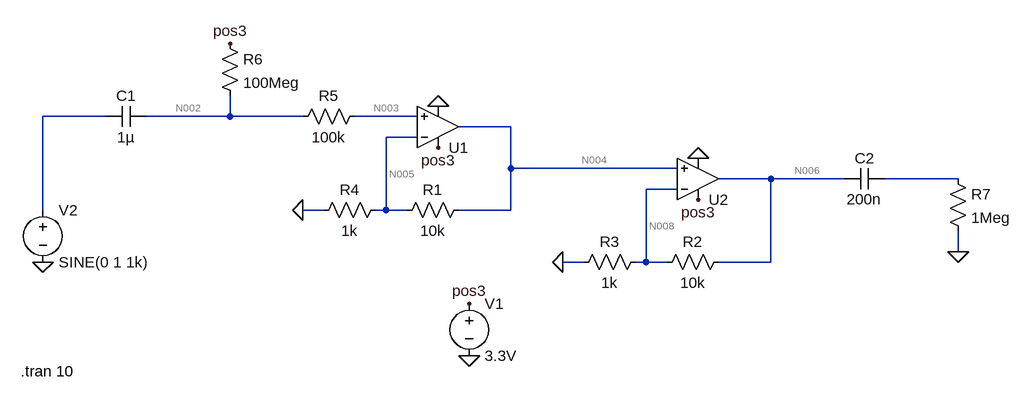
[diagram p0: schematic Draft1.asc]
Draft1.asc, the LTspice schematic file:
Version 4
SHEET 1 1000 680
WIRE -400 64 -496 64
WIRE -208 64 -208 32
WIRE -208 64 -336 64
WIRE -96 64 -208 64
WIRE 80 64 -16 64
WIRE 224 80 144 80
WIRE 80 96 32 96
WIRE 224 144 224 80
WIRE 480 144 224 144
WIRE 624 160 544 160
WIRE 736 160 624 160
WIRE 912 160 800 160
WIRE 480 176 432 176
WIRE -496 208 -496 64
WIRE -64 208 -96 208
WIRE 32 208 32 96
WIRE 32 208 16 208
WIRE 64 208 32 208
WIRE 224 208 224 144
WIRE 224 208 144 208
WIRE 912 272 912 240
WIRE 336 288 304 288
WIRE 432 288 432 176
WIRE 432 288 416 288
WIRE 464 288 432 288
WIRE 624 288 624 160
WIRE 624 288 544 288
FLAG 160 432 0
FLAG 160 352 pos3
FLAG 512 128 0
FLAG 512 192 pos3
FLAG 304 288 0
FLAG 112 48 0
FLAG 112 112 pos3
FLAG -96 208 0
FLAG -496 288 0
FLAG 912 272 0
FLAG -208 -48 pos3
SYMBOL voltage 160 336 R0
WINDOW 123 0 0 Left 0
WINDOW 39 0 0 Left 0
SYMATTR InstName V1
SYMATTR Value 3.3V
SYMBOL OpAmps\\UniversalOpamp2 512 160 M180
SYMATTR InstName U2
SYMBOL res 560 272 R90
WINDOW 0 0 56 VBottom 2
WINDOW 3 32 56 VTop 2
SYMATTR InstName R2
SYMATTR Value 10k
SYMBOL res 432 272 R90
WINDOW 0 0 56 VBottom 2
WINDOW 3 32 56 VTop 2
SYMATTR InstName R3
SYMATTR Value 1k
SYMBOL OpAmps\\UniversalOpamp2 112 80 M180
SYMATTR InstName U1
SYMBOL res 160 192 R90
WINDOW 0 0 56 VBottom 2
WINDOW 3 32 56 VTop 2
SYMATTR InstName R1
SYMATTR Value 10k
SYMBOL res 32 192 R90
WINDOW 0 0 56 VBottom 2
WINDOW 3 32 56 VTop 2
SYMATTR InstName R4
SYMATTR Value 1k
SYMBOL cap -336 48 R90
WINDOW 0 0 32 VBottom 2
WINDOW 3 32 32 VTop 2
SYMATTR InstName C1
SYMATTR Value 1µ
SYMBOL res 0 48 R90
WINDOW 0 0 56 VBottom 2
WINDOW 3 32 56 VTop 2
SYMATTR InstName R5
SYMATTR Value 100k
SYMBOL cap 800 144 R90
WINDOW 0 0 32 VBottom 2
WINDOW 3 32 32 VTop 2
SYMATTR InstName C2
SYMATTR Value 200n
SYMBOL voltage -496 192 R0
WINDOW 123 0 0 Left 0
WINDOW 39 0 0 Left 0
SYMATTR InstName V2
SYMATTR Value SINE(0 1 1k)
SYMBOL res 896 144 R0
SYMATTR InstName R7
SYMATTR Value 1Meg
SYMBOL res -224 -64 R0
SYMATTR InstName R6
SYMATTR Value 100Meg
TEXT -530 456 Left 2 !.tran 10

The netlist it stands for:
* Draft1.asc
V1 pos3 0 3.3V
XU2 N004 N008 pos3 0 N006 level.2 Avol=1Meg GBW=10Meg Slew=10Meg ilimit=25m rail=0 Vos=0 phimargin=45 en=0 enk=0 in=0 ink=0 Rin=500Meg  ; pins IN+ IN- V+ V- OUT
R2 N006 N008 10k
R3 N008 0 1k
XU1 N003 N005 pos3 0 N004 level.2 Avol=1Meg GBW=10Meg Slew=10Meg ilimit=25m rail=0 Vos=0 phimargin=45 en=0 enk=0 in=0 ink=0 Rin=500Meg  ; pins IN+ IN- V+ V- OUT
R1 N004 N005 10k
R4 N005 0 1k
C1 N002 N001 1µ
R5 N003 N002 100k
C2 N007 N006 200n
V2 N001 0 SINE(0 1 1k)
R7 N007 0 1Meg
R6 pos3 N002 100Meg
.tran 10
.lib UniversalOpamps2.sub
.backanno
.end

* Results of the author's LTspice run, read from the files saved beside the schematic
* Operating Point, zero values left out:
*   V(pos3) = 3.3 V
*   V(n006) = 3.297 V
*   V(n008) = 299.7 mV
*   V(n004) = 3.297 V
*   V(n005) = 299.7 mV
*   V(n003) = 3.025 V
*   V(n002) = 3.025 V
*   I(R6) = 2.75 nA
*   I(R5) = -2.75 nA
*   I(R4) = 299.7 µA
*   I(R1) = 299.7 µA
*   I(R3) = 299.7 µA
*   I(R2) = 299.7 µA
*   I(V1) = -600.1 µA
*   Ix(u2:1) = 3.293 nA
*   Ix(u2:2) = -2.701 nA
*   Ix(u2:3) = 300 µA
*   Ix(u2:4) = -405.1 nA
*   Ix(u2:5) = -299.7 µA
*   Ix(u1:1) = 2.75 nA
*   Ix(u1:2) = -2.701 nA
*   Ix(u1:3) = 300 µA
*   Ix(u1:4) = -404.8 nA
*   Ix(u1:5) = -299.7 µA